# EAGLE design 6502_cable_ada (EAGLE 9.5.2)
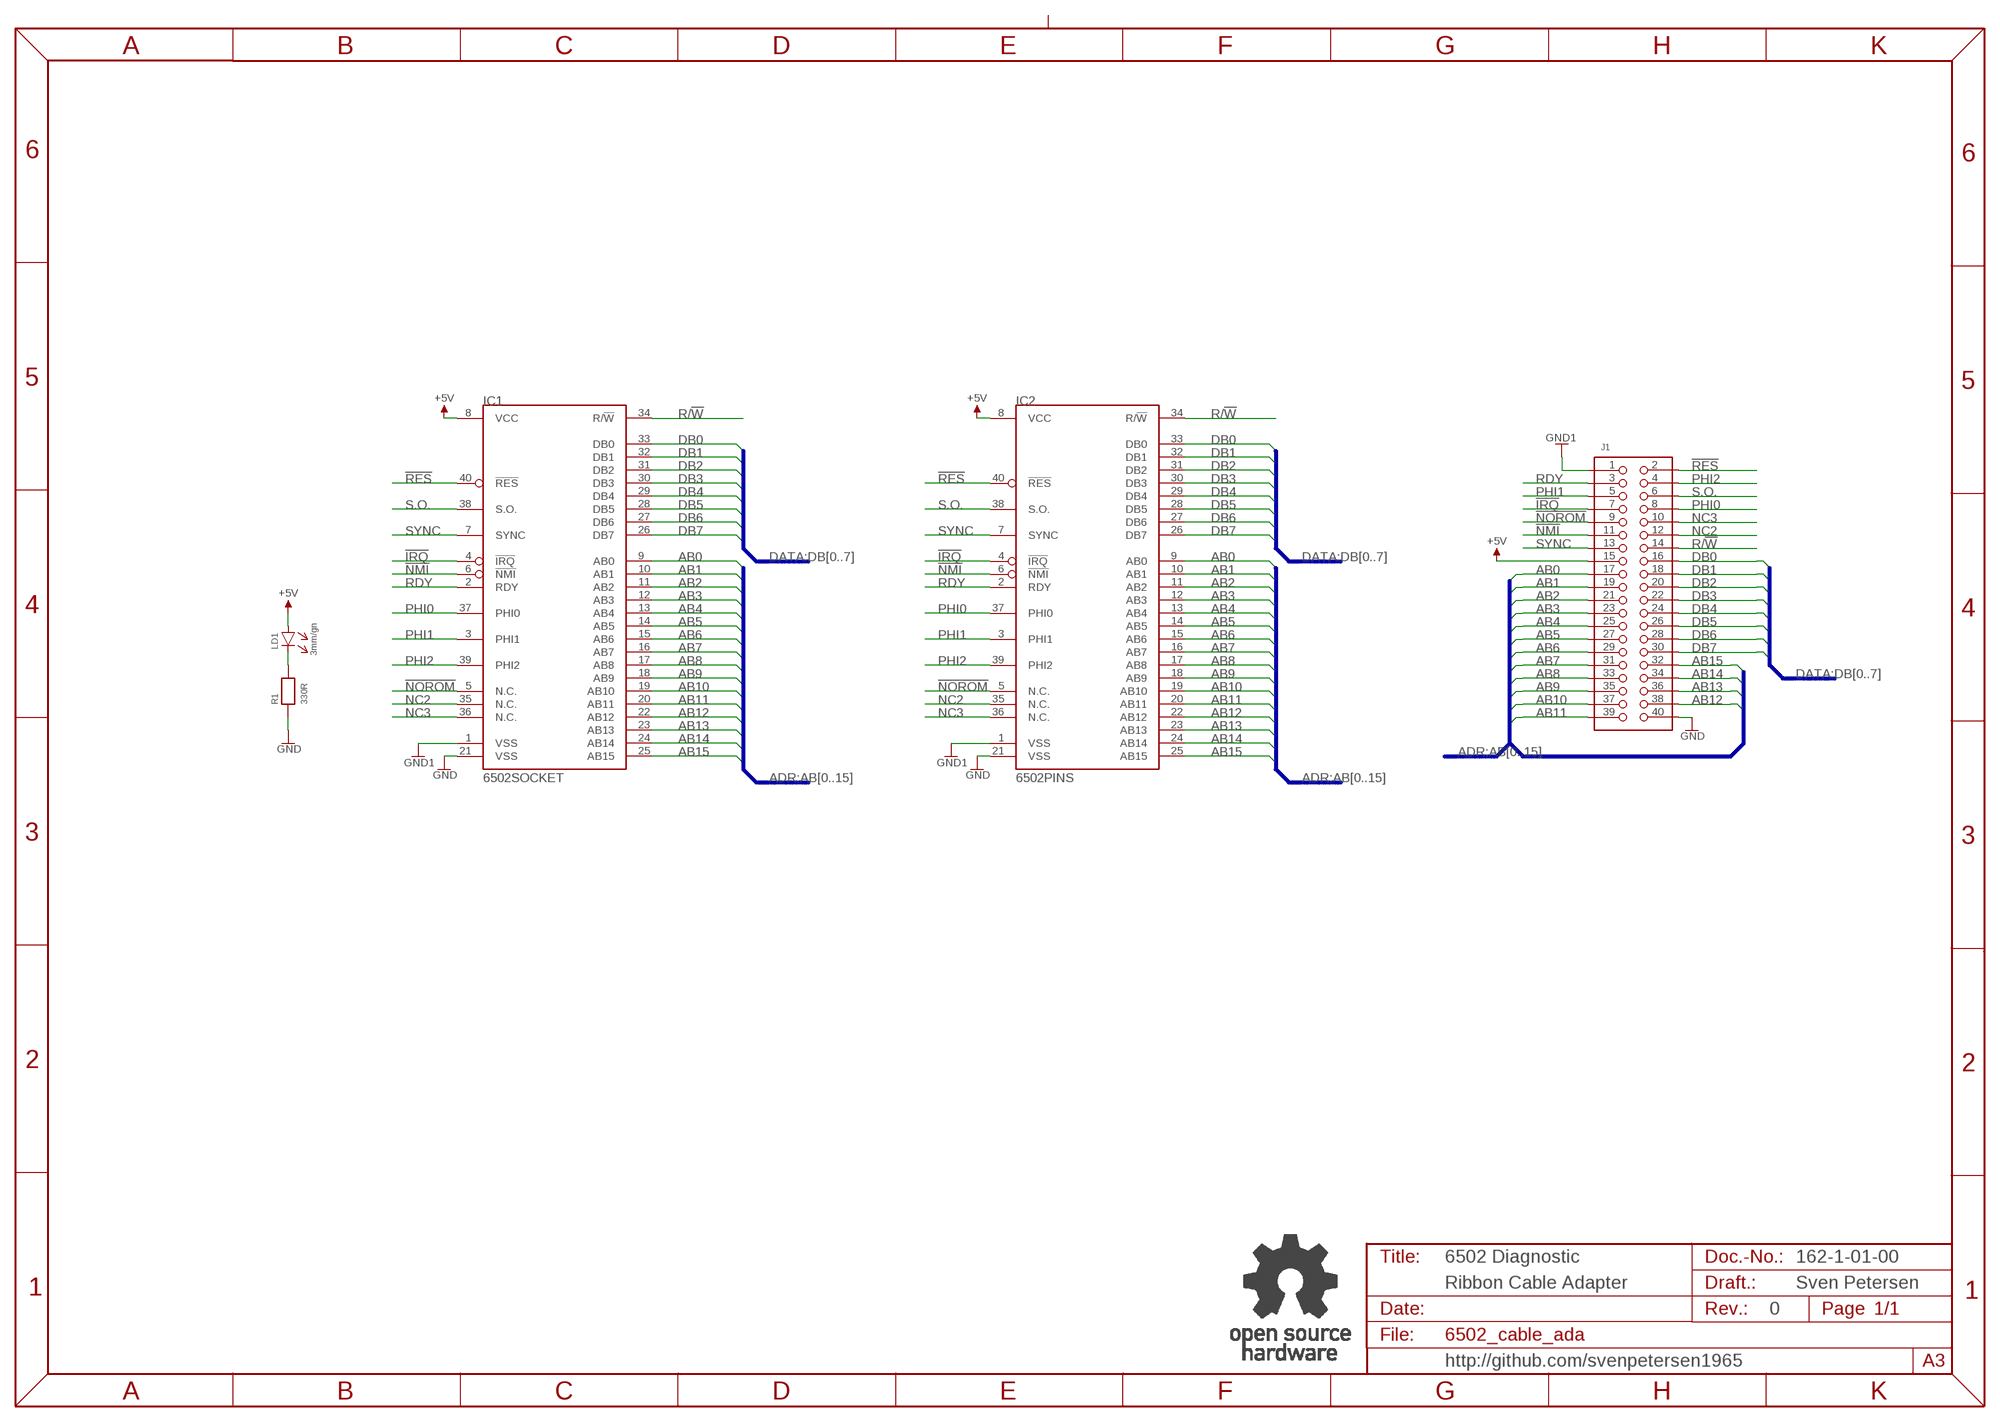
[diagram p0: schematic, sheet 1]

## Parts
IC1  6502SOCKET  [GS40P]
IC2  6502PINS  [DIL40_PINS_SS]
J1  PINHD-2X20WV  [2X20WV]
LD1  3mm/gn  3MM  [3MM]
R1  330R  RES04  [R-10]
U$11  OPEN_SOURCE_HW  [OPENHW]

## Nets
!IRQ: IC1.4(!IRQ) IC2.4(!IRQ) J1.7
!NMI: IC1.6(!NMI) IC2.6(!NMI) J1.11
!NOROM: IC1.5(N.C.) IC2.5(N.C.) J1.9
!RES: IC1.40(!RES) IC2.40(!RES) J1.2
+5V: IC1.8(VCC) IC2.8(VCC) J1.15 LD1.A
AB0: IC1.9(AB0) IC2.9(AB0) J1.17
AB1: IC1.10(AB1) IC2.10(AB1) J1.19
AB2: IC1.11(AB2) IC2.11(AB2) J1.21
AB3: IC1.12(AB3) IC2.12(AB3) J1.23
AB4: IC1.13(AB4) IC2.13(AB4) J1.25
AB5: IC1.14(AB5) IC2.14(AB5) J1.27
AB6: IC1.15(AB6) IC2.15(AB6) J1.29
AB7: IC1.16(AB7) IC2.16(AB7) J1.31
AB8: IC1.17(AB8) IC2.17(AB8) J1.33
AB9: IC1.18(AB9) IC2.18(AB9) J1.35
AB10: IC1.19(AB10) IC2.19(AB10) J1.37
AB11: IC1.20(AB11) IC2.20(AB11) J1.39
AB12: IC1.22(AB12) IC2.22(AB12) J1.38
AB13: IC1.23(AB13) IC2.23(AB13) J1.36
AB14: IC1.24(AB14) IC2.24(AB14) J1.34
AB15: IC1.25(AB15) IC2.25(AB15) J1.32
DB0: IC1.33(DB0) IC2.33(DB0) J1.16
DB1: IC1.32(DB1) IC2.32(DB1) J1.18
DB2: IC1.31(DB2) IC2.31(DB2) J1.20
DB3: IC1.30(DB3) IC2.30(DB3) J1.22
DB4: IC1.29(DB4) IC2.29(DB4) J1.24
DB5: IC1.28(DB5) IC2.28(DB5) J1.26
DB6: IC1.27(DB6) IC2.27(DB6) J1.28
DB7: IC1.26(DB7) IC2.26(DB7) J1.30
GND: IC1.21(VSS) IC2.21(VSS) J1.40 R1.1
GND1: IC1.1(VSS) IC2.1(VSS) J1.1
N$1: LD1.C(K) R1.2
NC2: IC1.35(N.C.) IC2.35(N.C.) J1.12
NC3: IC1.36(N.C.) IC2.36(N.C.) J1.10
PHI0: IC1.37(PHI0) IC2.37(PHI0) J1.8
PHI1: IC1.3(PHI1) IC2.3(PHI1) J1.5
PHI2: IC1.39(PHI2) IC2.39(PHI2) J1.4
R/!W: IC1.34(R/!W) IC2.34(R/!W) J1.14
RDY: IC1.2(RDY) IC2.2(RDY) J1.3
S.O.: IC1.38(S.O.) IC2.38(S.O.) J1.6
SYNC: IC1.7(SYNC) IC2.7(SYNC) J1.13

## Buses
DATA:DB[0..7]
ADR:AB[0..15]

## Notes on the sheet
- 6502 Diagnostic | 162-1-01-00
- Ribbon Cable Adapter | Sven Petersen
- 0
- http://github.com/svenpetersen1965

## Library data of the parts
IC1 IC2 = MOS:6502
J1 = PINHEAD:PINHD-2X20
LD1 = LED:3MM
R1 = DISCRETE:RES04
U$11 = Logo:OPEN_SOURCE_HW

## Board
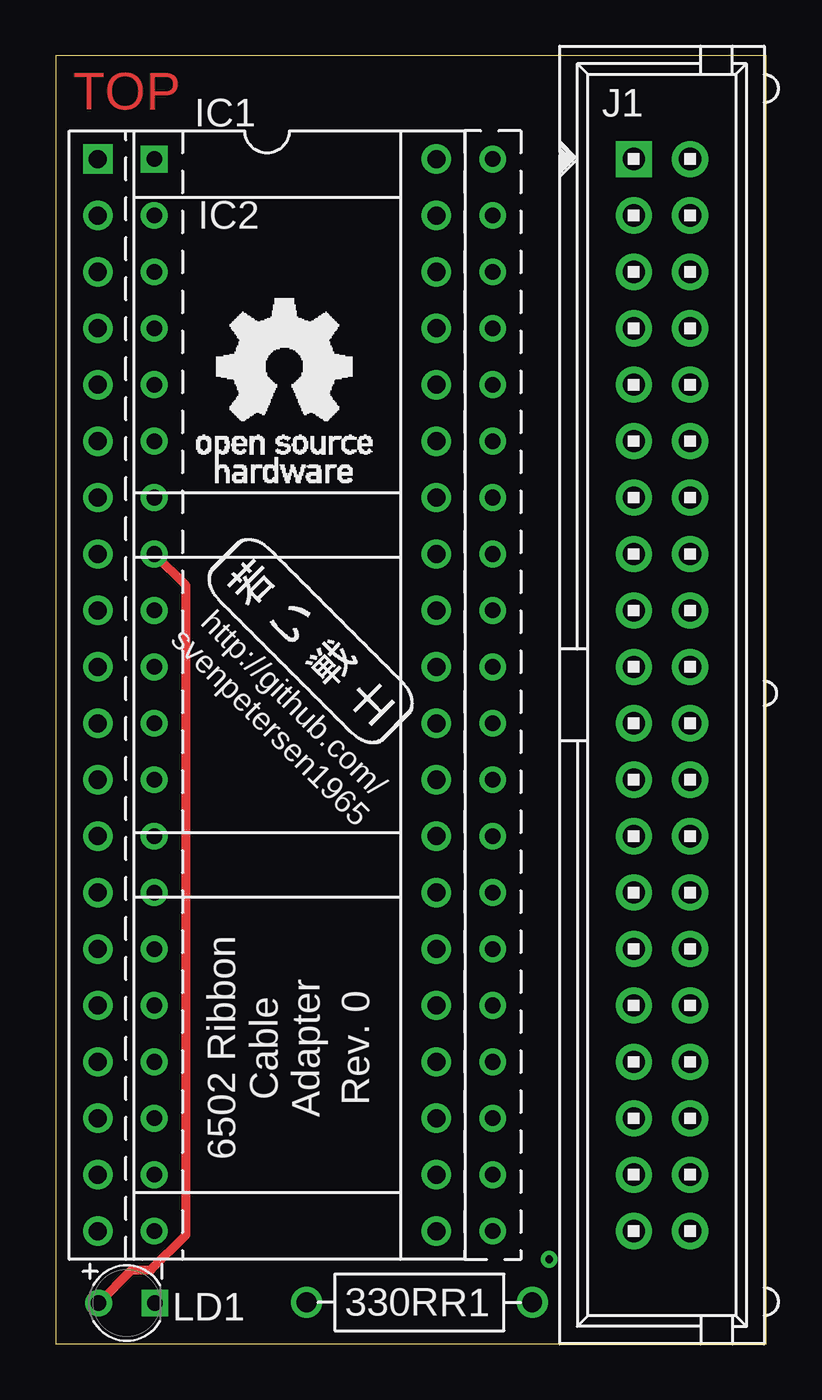
[diagram p1: board, top side]
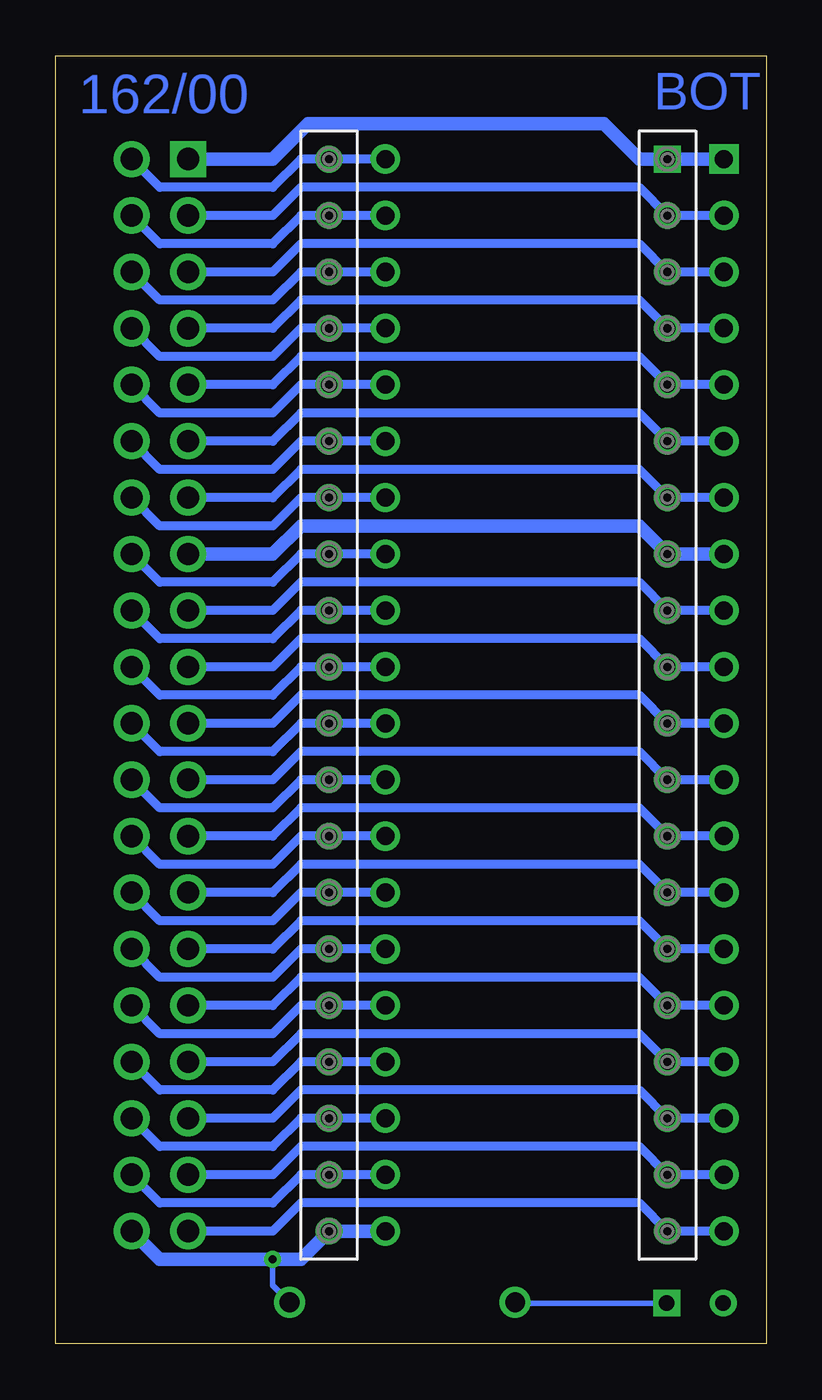
[diagram p2: board, bottom side, seen from below]

Size 32 x 58 mm. Coordinates in mm from the lower left corner, seen from the top.
Outline: 0,0 32,0 32,58 0,58 0,0
Copper layers (1*16): Top 0.035mm / dielectric 1.5mm / Bottom 0.035mm
Design rules "default *": minimum track width 6mil, minimum drill 0.35mm, track to track 6mil, track to pad 6mil, pad to pad 6mil, via to via 6mil, smd to smd 6mil, copper to edge 40mil, drill to drill 6mil, minimum pad ring 10mil, minimum via ring 8mil, stop-mask expansion 4mil, vias tented up to drill 25mil, thermal gap 10mil
bRestrict: 3 lines

### Footprints (pad centres in the part's own frame; a part is rotated, then mirrored left to right if it is on the bottom)
GS40P = drill 0.813 square: 1 -24.13,-7.62 | drill 0.813: 2 -21.59,-7.62; 3 -19.05,-7.62; 4 -16.51,-7.62; 5 -13.97,-7.62; 6 -11.43,-7.62; 7 -8.89,-7.62; 8 -6.35,-7.62; 9 -3.81,-7.62; 10 -1.27,-7.62; 11 1.27,-7.62; 12 3.81,-7.62; 13 6.35,-7.62; 14 8.89,-7.62; 15 11.43,-7.62; 16 13.97,-7.62; 17 16.51,-7.62; 18 19.05,-7.62; 19 21.59,-7.62; 20 24.13,-7.62; 21 24.13,7.62; 22 21.59,7.62; 23 19.05,7.62; 24 16.51,7.62; 25 13.97,7.62; 26 11.43,7.62; 27 8.89,7.62; 28 6.35,7.62; 29 3.81,7.62; 30 1.27,7.62; 31 -1.27,7.62; 32 -3.81,7.62; 33 -6.35,7.62; 34 -8.89,7.62; 35 -11.43,7.62; 36 -13.97,7.62; 37 -16.51,7.62; 38 -19.05,7.62; 39 -21.59,7.62; 40 -24.13,7.62
DIL40_PINS_SS = drill 0.7 square: 1 -24.13,-7.62 | drill 0.7: 2 -21.59,-7.62; 3 -19.05,-7.62; 4 -16.51,-7.62; 5 -13.97,-7.62; 6 -11.43,-7.62; 7 -8.89,-7.62; 8 -6.35,-7.62; 9 -3.81,-7.62; 10 -1.27,-7.62; 11 1.27,-7.62; 12 3.81,-7.62; 13 6.35,-7.62; 14 8.89,-7.62; 15 11.43,-7.62; 16 13.97,-7.62; 17 16.51,-7.62; 18 19.05,-7.62; 19 21.59,-7.62; 20 24.13,-7.62; 21 24.13,7.62; 22 21.59,7.62; 23 19.05,7.62; 24 16.51,7.62; 25 13.97,7.62; 26 11.43,7.62; 27 8.89,7.62; 28 6.35,7.62; 29 3.81,7.62; 30 1.27,7.62; 31 -1.27,7.62; 32 -3.81,7.62; 33 -6.35,7.62; 34 -8.89,7.62; 35 -11.43,7.62; 36 -13.97,7.62; 37 -16.51,7.62; 38 -19.05,7.62; 39 -21.59,7.62; 40 -24.13,7.62
2X20WV = drill 1 pad 1.626 square: 1 -24.13,-1.27 | drill 1 pad 1.626: 2 -24.13,1.27; 3 -21.59,-1.27; 4 -21.59,1.27; 5 -19.05,-1.27; 6 -19.05,1.27; 7 -16.51,-1.27; 8 -16.51,1.27; 9 -13.97,-1.27; 10 -13.97,1.27; 11 -11.43,-1.27; 12 -11.43,1.27; 13 -8.89,-1.27; 14 -8.89,1.27; 15 -6.35,-1.27; 16 -6.35,1.27; 17 -3.81,-1.27; 18 -3.81,1.27; 19 -1.27,-1.27; 20 -1.27,1.27; 21 1.27,-1.27; 22 1.27,1.27; 23 3.81,-1.27; 24 3.81,1.27; 25 6.35,-1.27; 26 6.35,1.27; 27 8.89,-1.27; 28 8.89,1.27; 29 11.43,-1.27; 30 11.43,1.27; 31 13.97,-1.27; 32 13.97,1.27; 33 16.51,-1.27; 34 16.51,1.27; 35 19.05,-1.27; 36 19.05,1.27; 37 21.59,-1.27; 38 21.59,1.27; 39 24.13,-1.27; 40 24.13,1.27
3MM = drill 0.7: A -1.27,0 | drill 0.7 square: C 1.27,0
R-10 = drill 0.889 pad 1.397: 1 -5.08,0; 2 5.08,0

### Placement (x,y rotation side)
IC1  9.53,29.21 270 top
IC2  12.06,29.21 270 top
J1  27.3,29.21 270 top
LD1  3.21,1.84 0 top
R1  16.38,1.87 180 top
U$11  6.37,38.78 0 top
U$12  [PCB-TITLE/]  0,66.04 0 top  (outside the outline)
U$13  [2LAYER]  0.79,55.56 0 top
U$14  [SVEN_TAG]  11.43,31.75 45 top

### Tracks (layer width: path | path; a pad name or v marks a point on that pad's centre or on a via)
!IRQ
  Bottom 0.406: IC1.4 IC2.4 5.71,46.99 20.95,46.99 22.23,45.72 J1.7
!NMI
  Bottom 0.406: IC1.6 IC2.6 5.71,41.91 20.95,41.91 22.23,40.64 J1.11
!NOROM
  Bottom 0.406: IC1.5 IC2.5 5.71,44.45 20.95,44.45 22.23,43.18 J1.9
!RES
  Bottom 0.406: IC1.40 IC2.40 20.95,53.34 22.23,52.07 27.3,52.07 J1.2
+5V
  Top 0.406: LD1.A 3.43,3.33 4.29,3.33 5.87,4.92 5.87,34.13 IC2.8
  Bottom 0.61: IC1.8 IC2.8 5.71,36.83 20.95,36.83 22.23,35.56 J1.15
AB0
  Bottom 0.406: IC1.9 IC2.9 5.71,34.29 20.95,34.29 22.23,33.02 J1.17
AB1
  Bottom 0.406: IC1.10 IC2.10 5.71,31.75 20.95,31.75 22.23,30.48 J1.19
AB2
  Bottom 0.406: IC1.11 IC2.11 5.71,29.21 20.95,29.21 22.23,27.94 J1.21
AB3
  Bottom 0.406: IC1.12 IC2.12 5.71,26.67 20.95,26.67 22.23,25.4 J1.23
AB4
  Bottom 0.406: IC1.13 IC2.13 5.71,24.13 20.95,24.13 22.23,22.86 J1.25
AB5
  Bottom 0.406: IC1.14 IC2.14 5.71,21.59 20.95,21.59 22.23,20.32 J1.27
AB6
  Bottom 0.406: IC1.15 IC2.15 5.71,19.05 20.95,19.05 22.23,17.78 J1.29
AB7
  Bottom 0.406: IC1.16 IC2.16 5.71,16.51 20.95,16.51 22.23,15.24 J1.31
AB8
  Bottom 0.406: IC1.17 IC2.17 5.71,13.97 20.95,13.97 22.23,12.7 J1.33
AB9
  Bottom 0.406: IC1.18 IC2.18 5.71,11.43 20.95,11.43 22.23,10.16 J1.35
AB10
  Bottom 0.406: IC1.19 IC2.19 5.71,8.89 20.95,8.89 22.23,7.62 J1.37
AB11
  Bottom 0.406: IC1.20 IC2.20 5.71,6.35 20.95,6.35 22.23,5.08 J1.39
AB12
  Bottom 0.406: IC1.22 IC2.22 20.95,7.62 22.23,6.35 27.3,6.35 J1.38
AB13
  Bottom 0.406: IC1.23 IC2.23 20.95,10.16 22.23,8.89 27.3,8.89 J1.36
AB14
  Bottom 0.406: IC1.24 IC2.24 20.95,12.7 22.23,11.43 27.3,11.43 J1.34
AB15
  Bottom 0.406: IC1.25 IC2.25 20.95,15.24 22.23,13.97 27.3,13.97 J1.32
DB0
  Bottom 0.406: IC1.33 IC2.33 20.95,35.56 22.23,34.29 27.3,34.29 J1.16
DB1
  Bottom 0.406: IC1.32 IC2.32 20.95,33.02 22.23,31.75 27.3,31.75 J1.18
DB2
  Bottom 0.406: IC1.31 IC2.31 20.95,30.48 22.23,29.21 27.3,29.21 J1.20
DB3
  Bottom 0.406: IC1.30 IC2.30 20.95,27.94 22.23,26.67 27.3,26.67 J1.22
DB4
  Bottom 0.406: IC1.29 IC2.29 20.95,25.4 22.23,24.13 27.3,24.13 J1.24
DB5
  Bottom 0.406: IC1.28 IC2.28 20.95,22.86 22.23,21.59 27.3,21.59 J1.26
DB6
  Bottom 0.406: IC1.27 IC2.27 20.95,20.32 22.23,19.05 27.3,19.05 J1.28
DB7
  Bottom 0.406: IC1.26 IC2.26 20.95,17.78 22.23,16.51 27.3,16.51 J1.30
GND  (via drill 0.35)
  Bottom 0.254: R1.1 22.23,2.63 v22.23,3.81
  Bottom 0.61: IC1.21 IC2.21 20.95,3.81 v22.23,3.81 27.3,3.81 J1.40
GND1
  Bottom 0.61: IC1.1 IC2.1 5.71,53.34 7.3,54.93 20.64,54.93 22.23,53.34 J1.1
N$1
  Bottom 0.254: LD1.C 11.27,1.84 R1.2
NC2
  Bottom 0.406: IC1.35 IC2.35 20.95,40.64 22.23,39.37 27.3,39.37 J1.12
NC3
  Bottom 0.406: IC1.36 IC2.36 20.95,43.18 22.23,41.91 27.3,41.91 J1.10
PHI0
  Bottom 0.406: IC1.37 IC2.37 20.95,45.72 22.23,44.45 27.3,44.45 J1.8
PHI1
  Bottom 0.406: IC1.3 IC2.3 5.71,49.53 20.95,49.53 22.23,48.26 J1.5
PHI2
  Bottom 0.406: IC1.39 IC2.39 20.95,50.8 22.23,49.53 27.3,49.53 J1.4
R/!W
  Bottom 0.406: IC1.34 IC2.34 20.95,38.1 22.23,36.83 27.3,36.83 J1.14
RDY
  Bottom 0.406: IC1.2 IC2.2 5.71,52.07 20.95,52.07 22.23,50.8 J1.3
S.O.
  Bottom 0.406: IC1.38 IC2.38 20.95,48.26 22.23,46.99 27.3,46.99 J1.6
SYNC
  Bottom 0.406: IC1.7 IC2.7 5.71,39.37 20.95,39.37 22.23,38.1 J1.13

### Text on the board
Bottom: 162/00
tPlace: http://github.com/ / svenpetersen1965 | 6502 Ribbon / Cable / Adapter | Rev. 0 | 330R
Document: 162-2-01-00 | Sven Petersen / 2020 | 35µm | 2 | 0